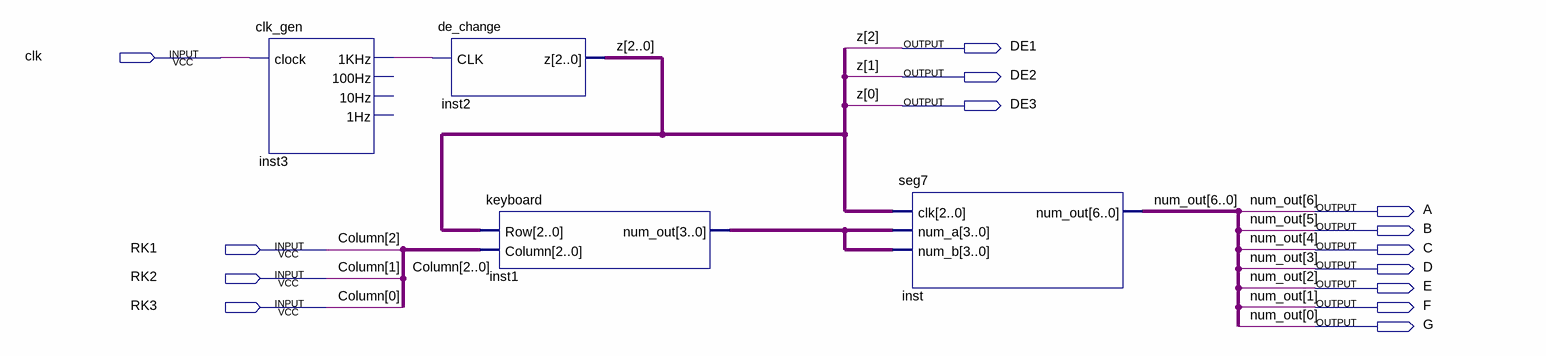
[diagram p0: schematic sheet]
// Quartus schematic key_to_seg7.bdf as structural Verilog: 4 symbols, 14 pins
module key_to_seg7 (
  input  clk,
  input  RK1,
  input  RK2,
  input  RK3,
  output DE1,
  output DE2,
  output DE3,
  output A,
  output B,
  output C,
  output D,
  output E,
  output F,
  output G
);

  wire inst3_1khz;
  wire [3:0] inst1_num_out;

  clk_gen inst3 (.clock(clk), .\1KHz (inst3_1khz));  // open: 100Hz, 10Hz, 1Hz
  de_change inst2 (.CLK(inst3_1khz), .z({DE1, DE2, DE3}));
  keyboard inst1 (.Row({DE1, DE2, DE3}), .Column({RK1, RK2, RK3}), .num_out(inst1_num_out));
  seg7 inst (.clk({DE1, DE2, DE3}), .num_a(inst1_num_out), .num_b(inst1_num_out), .num_out({A, B, C, D, E, F, G}));

  // Other names for the same wires on the sheet: Column[2:0] = {RK1, RK2, RK3}; num_out[6:0] = {A, B, C, D, E, F, G};
  //   z[2:0] = {DE1, DE2, DE3}
endmodule
